# EAGLE design Lampeleon (EAGLE 9.5.1)
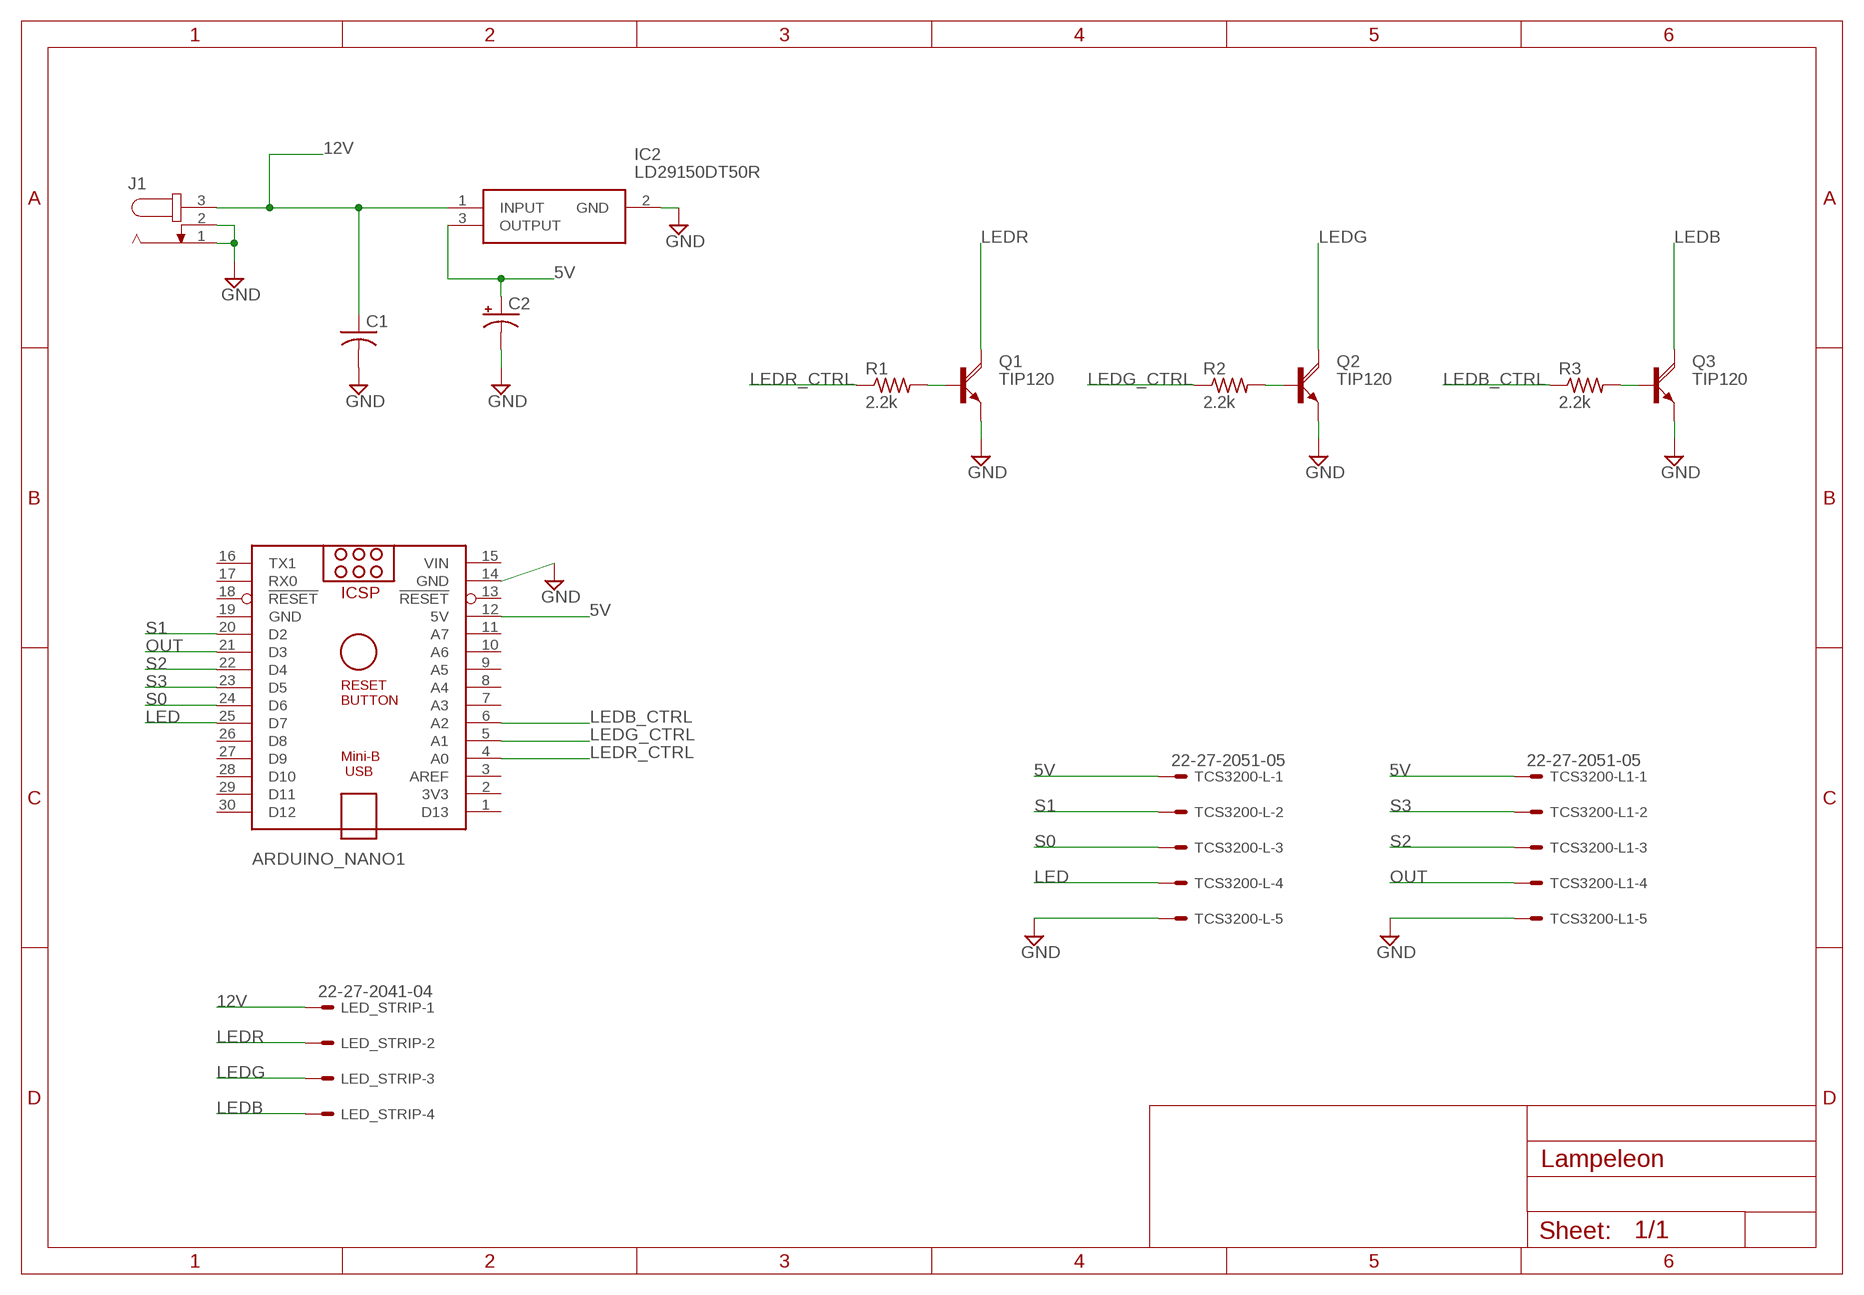
[diagram p0: schematic, sheet 1]

## Parts
ARDUINO_NANO1  ARDUINO_NANO  [ARDUINO_NANO]
C1  C-US025-030X050  [C025-030X050]
C2  CPOL-USE2.5-5  [E2,5-5]
IC2  LD29150DT50R  [LD29150DT50R]
J1  JACK-PLUG0  [SPC4077]
LED_STRIP  22-27-2041-04  [6410-04]
Q1  TIP120  [TO220AH]
Q2  TIP120  [TO220AH]
Q3  TIP120  [TO220AH]
R1  2.2k  R-US_0204/5  [0204/5]
R2  2.2k  R-US_0204/5  [0204/5]
R3  2.2k  R-US_0204/5  [0204/5]
TCS3200-L  22-27-2051-05  [6410-05]
TCS3200-L1  22-27-2051-05  [6410-05]

## Nets
5V: ARDUINO_NANO1.12(5V) C2.+ IC2.3(OUTPUT) TCS3200-L1.1 TCS3200-L.1
12V: C1.1 IC2.1(INPUT) J1.3 LED_STRIP.1
GND: ARDUINO_NANO1.14(GND) C1.2 C2.- IC2.2(GND) J1.1 J1.2 Q1.E Q2.E Q3.E TCS3200-L1.5 TCS3200-L.5
LED: ARDUINO_NANO1.25(D7) TCS3200-L.4
LEDB: LED_STRIP.4 Q3.C
LEDB_CTRL: ARDUINO_NANO1.6(A2) R3.1
LEDG: LED_STRIP.3 Q2.C
LEDG_CTRL: ARDUINO_NANO1.5(A1) R2.1
LEDR: LED_STRIP.2 Q1.C
LEDR_CTRL: ARDUINO_NANO1.4(A0) R1.1
N$2: Q2.B R2.2
N$3: Q1.B R1.2
N$4: Q3.B R3.2
OUT: ARDUINO_NANO1.21(D3) TCS3200-L1.4
S0: ARDUINO_NANO1.24(D6) TCS3200-L.3
S1: ARDUINO_NANO1.20(D2) TCS3200-L.2
S2: ARDUINO_NANO1.22(D4) TCS3200-L1.3
S3: ARDUINO_NANO1.23(D5) TCS3200-L1.2
Unconnected: ARDUINO_NANO1.1(D13) ARDUINO_NANO1.2(3V3) ARDUINO_NANO1.3(AREF) ARDUINO_NANO1.7(A3) ARDUINO_NANO1.8(A4) ARDUINO_NANO1.9(A5) ARDUINO_NANO1.10(A6) ARDUINO_NANO1.11(A7) ARDUINO_NANO1.13(!RESET) ARDUINO_NANO1.16(TX1) ARDUINO_NANO1.17(RX0) ARDUINO_NANO1.18(!RESET) ARDUINO_NANO1.26(D8) ARDUINO_NANO1.27(D9) ARDUINO_NANO1.28(D10) ARDUINO_NANO1.29(D11) ARDUINO_NANO1.30(D12)

## Power pins joined to a net without a drawn wire
GND: ARDUINO_NANO1.19(GND)
VIN: ARDUINO_NANO1.15(VIN)

## Library data of the parts
ARDUINO_NANO1 = ArduinoNanoV30:ARDUINO_NANO: Arduino Nano V3.0 Overview: The Arduino Nano is a small, complete, and breadboard-friendly board based on the ATmega328 (Arduino Nano 3.x) or ATmega168 (Arduino Nano 2.x). It has more or less the same functionality of the Arduino Duemilanove, but in a different package. It lacks only a DC power jack, and works with a Mini-B USB cable instead of a standard one. The Nano was designed and is being produced by Gravitech. Specifications: Microcontroller Atmel ATmega168 or ATmega328 Operating Voltage (logic level) 5 V Input Voltage (recommended) 7-12 V Input Voltage (limits) 6-20 V Digital I/O Pins 14 (of which 6 provide PWM output) Analog Input Pins 8 DC Current per I/O Pin 40 mA Flash Memory 16 KB (ATmega168) or 32 KB (ATmega328) of which 2 KB used by bootloader SRAM 1 KB (ATmega168) or 2 KB (ATmega328) EEPROM 512 bytes (ATmega168) or 1 KB (ATmega328) Clock Speed 16 MHz Dimensions 0.73" x 1.70" Length 45 mm Width 18 mm Weigth 5 g Power: The Arduino Nano can be powered via the Mini-B USB connection, 6-20V unregulated external power supply (pin 30), or 5V regulated external power supply (pin 27). The power source is automatically selected to the highest voltage source. Memory: The ATmega168 has 16 KB of flash memory for storing code (of which 2 KB is used for the bootloader); the ATmega328 has 32 KB, (also with 2 KB used for the bootloader). The ATmega168 has 1 KB of SRAM and 512 bytes of EEPROM (which can be read and written with the EEPROM library); the ATmega328 has 2 KB of SRAM and 1 KB of EEPROM. Input and Output: Each of the 14 digital pins on the Nano can be used as an input or output, using pinMode(), digitalWrite(), and digitalRead() functions. They operate at 5 volts. Each pin can provide or receive a maximum of 40 mA and has an internal pull-up resistor (disconnected by default) of 20-50 kOhms. In addition, some pins have specialized functions. Visit Arduino - ArduinoBoardNano <https://www.arduino.cc/en/Main/ArduinoBoardNano>
C1 = adafruit:C-US: CAPACITOR, American symbol
C2 = adafruit:CPOL-US: POLARIZED CAPACITOR, American symbol
IC2 = LD29150DT50R:LD29150DT50R: LDO Voltage Regulators 5.0V 1.5A Very Low Source: Datasheet <http://uk.rs-online.com/web/p/products/6868708>; DESCRIPTION: LDO Voltage Regulators 5.0V 1.5A Very Low; HEIGHT: 2.4mm; MANUFACTURER_NAME: STMicroelectronics; MANUFACTURER_PART_NUMBER: LD29150DT50R; RS_PART_NUMBER: 6868708; RS_PRICE-STOCK: http://uk.rs-online.com/web/p/products/6868708
J1 = con-jack:JACK-PLUG: DC POWER JACK Power Jack, DC, Right Angle, Through Hole, Rated 5A at 16VDC, PC Terminals Distributor: Farnell (www.Farnell.de) Drawing: 84N1161.pdf / 84N1162.pdf Manufacturer: SPC Technology (www.spctechnology.com) Type: SPC4077 / SPC 4078; OC_FARNELL: unknown; OC_NEWARK: unknown
LED_STRIP = con-molex:22-?-04: CONNECTOR wire to board 2.54 mm (.1 inch) pitch header; MF: MOLEX; OC_FARNELL: unknown; OC_NEWARK: unknown
Q1-Q3 = transistor-power:TIP120: NPN DARLINGTON TRANSISTOR
R1-R3 = adafruit:R-US_: RESISTOR, American symbol
TCS3200-L TCS3200-L1 = con-molex:22-?-05: CONNECTOR wire to board 2.54 mm (.1 inch) pitch header; MF: MOLEX; OC_FARNELL: unknown; OC_NEWARK: unknown

## Board
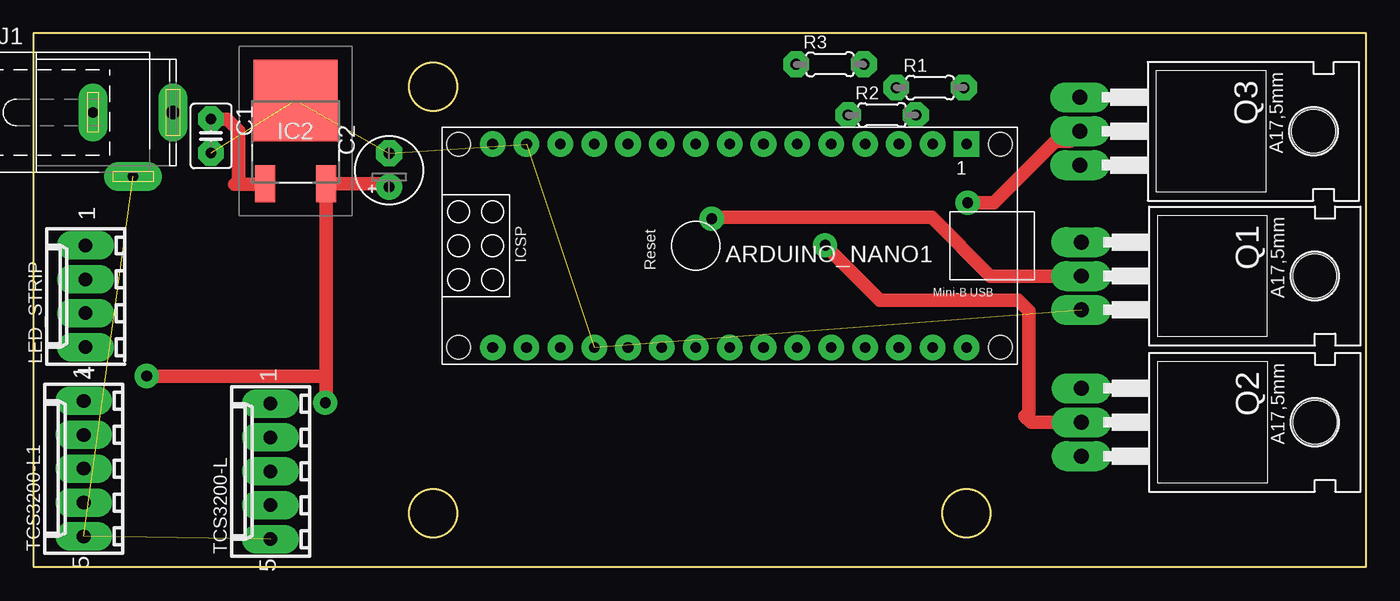
[diagram p1: board, top side]
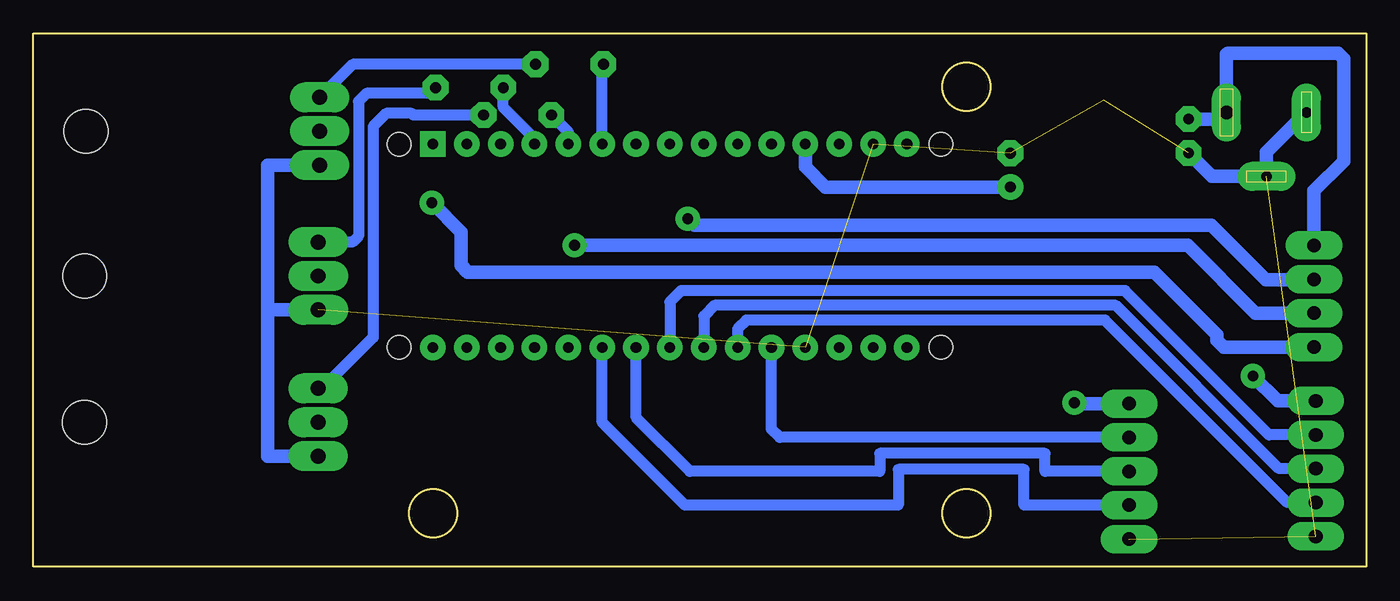
[diagram p2: board, bottom side, seen from below]

Size 100 x 40 mm. Coordinates in mm from the lower left corner, seen from the top.
Outline: 0,0 100,0 100,40 0,40 0,0
Outline: circle at 30,36 radius 1.8
Outline: circle at 70,4 radius 1.8
Outline: circle at 30,4 radius 1.8
Copper layers (1*16): Top 0.035mm / dielectric 1.5mm / Bottom 0.035mm
Design rules "large_pads *": minimum track width 16mil, minimum drill 0.8mm, track to track 6mil, track to pad 6mil, pad to pad 6mil, via to via 6mil, smd to smd 6mil, copper to edge 10mil, drill to drill 6mil, minimum pad ring 22mil, minimum via ring 20mil, stop-mask expansion 4mil, vias tented up to drill 0mil, thermal gap 10mil

### Footprints (pad centres in the part's own frame; a part is rotated, then mirrored left to right if it is on the bottom)
ARDUINO_NANO = drill 0.8 square: 1 -20.32,-7.62 | drill 0.8: 2 -17.78,-7.62; 3 -15.24,-7.62; 4 -12.7,-7.62; 5 -10.16,-7.62; 6 -7.62,-7.62; 7 -5.08,-7.62; 8 -2.54,-7.62; 9 0,-7.62; 10 2.54,-7.62; 11 5.08,-7.62; 12 7.62,-7.62; 13 10.16,-7.62; 14 12.7,-7.62; 15 15.24,-7.62; 16 15.24,7.62; 17 12.7,7.62; 18 10.16,7.62; 19 7.62,7.62; 20 5.08,7.62; 21 2.54,7.62; 22 0,7.62; 23 -2.54,7.62; 24 -5.08,7.62; 25 -7.62,7.62; 26 -10.16,7.62; 27 -12.7,7.62; 28 -15.24,7.62; 29 -17.78,7.62; 30 -20.32,7.62 | hole 1.778: -22.86,-7.62; -22.86,7.62; 17.78,7.62; 17.78,-7.62
C025-030X050 = drill 0.813 pad 1.422 octagon: 1 -1.27,0; 2 1.27,0
E2,5-5 = drill 0.813 pad 1.6: + -1.27,0 | drill 0.813 pad 1.6 octagon: - 1.27,0
LD29150DT50R = smd 1.5 x 2.8: 1 -2.286,-3.125; 3 2.286,-3.125 | smd 6.3 x 6.1: 2 0,3.125
SPC4077 = drill 0.8 pad 2.184 long: 1 -3,0; 2 0,-4.8 | drill 1 pad 2.184 long: 3 3,0
6410-04 = drill 1.016 long: 1 3.81,0; 2 1.27,0; 3 -1.27,0; 4 -3.81,0
TO220AH = drill 1.118 long: B -2.54,-6.35; C 0,-6.35; E 2.54,-6.35 | hole 3.302: 0,11.176
0204/5 = drill 0.813 pad 1.676 octagon: 1 -2.54,0; 2 2.54,0
6410-05 = drill 1.016 long: 1 5.08,0; 2 2.54,0; 3 0,0; 4 -2.54,0; 5 -5.08,0

### Placement (x,y rotation side)
ARDUINO_NANO1  49.7,24.07 180 top
C1  13.33,32.3 270 top
C2  26.7,29.74 90 top
IC2  19.68,31.84 0 top
J1  7.48,34.07 0 top
LED_STRIP  3.92,20.28 90 top
Q1  84.97,21.8 270 top
Q2  84.98,10.83 270 top
Q3  84.87,32.66 270 top
R1  67.28,35.93 0 top
R2  63.67,33.87 0 top
R3  59.77,37.68 0 top
TCS3200-L  17.8,7.15 90 top
TCS3200-L1  3.78,7.35 90 top

### Tracks (layer width: path | path; a pad name or v marks a point on that pad's centre or on a via)
5V  (via drill 0.8)
  Top 1.016: C2.+ 26.45,28.71 IC2.3 21.97,14.3 | 21.97,14.3 21.97,12.3 v21.9,12.3 | v8.5,14.3 21.97,14.3
  Bottom 1.016: C2.+ 40.57,28.47 42.08,29.98 ARDUINO_NANO1.12 | v21.9,12.3 21.9,12.23 TCS3200-L.1 | TCS3200-L1.1 6.63,12.43 v8.5,14.3
12V
  Top 1.016: C1.1 14.53,33.57 15.4,32.7 15.4,29 15.1,28.7 IC2.1
  Bottom 1.016: C1.1 10.98,33.57 J1.3 10.48,38.42 10.4,38.5 2.1,38.5 1.7,38.1 1.7,30.4 3.92,28.18 LED_STRIP.1
GND  (7 unrouted)
  Bottom 1.016: J1.1 7.48,31.07 J1.2 11.57,29.27 C1.2 | Q3.E 82.4,30.12 82.4,19.26 | Q1.E 82.4,19.26 | 82.4,19.26 82.4,8.29 Q2.E
LED
  Bottom 0.813: ARDUINO_NANO1.25 57.32,10.82 51.11,4.61 35.1,4.61 35.1,7.3 25.66,7.3 25.66,4.61 TCS3200-L.4
LEDB  (via drill 0.8)
  Top 1.016: Q3.C 77.76,31.9 76.67,31.9 72.07,27.3 v70.1,27.3
  Bottom 1.016: v70.1,27.3 67.9,25.1 67.9,22.6 67.4,22.1 15.9,22.1 11.2,17.4 11.2,17 10.67,16.47 LED_STRIP.4
LEDB_CTRL
  Bottom 0.813: ARDUINO_NANO1.6 57.32,37.59 R3.1
LEDG  (via drill 0.8)
  Top 1.016: v59.4,24.1 63.5,20 73.9,20 74.7,19.2 74.7,11.6 74.4,11.3 74.87,10.83 Q2.C
  Bottom 1.016: LED_STRIP.3 8.31,19.01 13.4,24.1 v59.4,24.1
LEDG_CTRL
  Bottom 0.813: R2.1 59.86,32.6 ARDUINO_NANO1.5
LEDR  (via drill 0.8)
  Top 1.016: v50.9,26.1 51,26.2 67.4,26.2 71.8,21.8 Q1.C
  Bottom 1.016: LED_STRIP.2 3.96,21.51 7.53,21.51 11.62,25.6 50.4,25.6 v50.9,26.1
LEDR_CTRL
  Bottom 0.813: ARDUINO_NANO1.4 62.4,32.1 64.74,34.44 64.74,34.48 R1.1
N$2
  Bottom 0.813: R2.2 71.47,33.87 71.6,34 73.52,34 74.5,33.02 74.5,17.2 78.33,13.37 Q2.B
N$3
  Bottom 0.813: R1.2 70.25,35.5 75,35.5 75.6,34.9 75.6,24.8 76.06,24.34 Q1.B
N$4
  Bottom 0.813: R3.2 76.04,37.68 Q3.B
OUT
  Bottom 0.813: TCS3200-L1.4 5.91,4.81 19.6,18.5 46.5,18.5 47.16,17.84 ARDUINO_NANO1.21
S0
  Bottom 0.813: ARDUINO_NANO1.24 54.78,11.18 50.75,7.15 36.5,7.15 36.5,8.5 24.1,8.5 24.1,7.15 TCS3200-L.3
S1
  Bottom 0.813: TCS3200-L.2 43.99,9.69 44.62,10.32 ARDUINO_NANO1.20
S2
  Bottom 0.813: TCS3200-L1.3 6.55,7.35 18.8,19.6 48.9,19.6 49.7,18.8 ARDUINO_NANO1.22
S3
  Bottom 0.813: TCS3200-L1.2 7.29,9.89 18.1,20.7 51.4,20.7 52.24,19.86 ARDUINO_NANO1.23

### Text on the board
tCream: V / R / G / B | Lampeleon | 5V / S3 / S2 / O / G | 5V / S1 / S0 / L / G